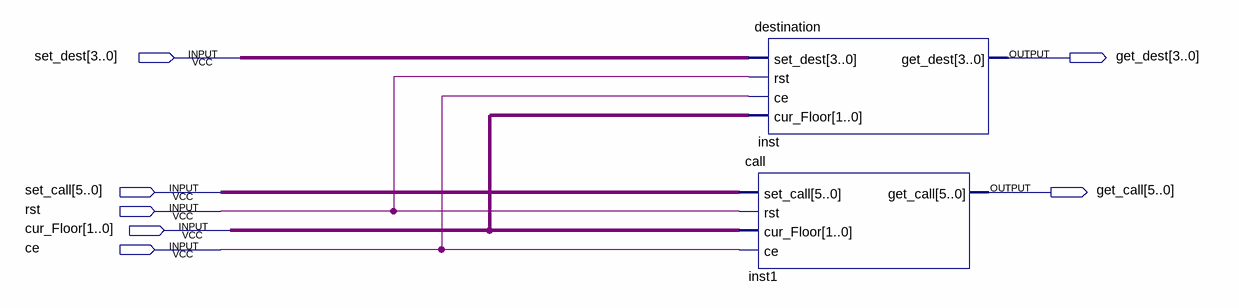
[diagram p0: schematic sheet]
// Quartus schematic request.bdf as structural Verilog: 2 symbols, 7 pins
module request (
  input  [3:0] set_dest,
  input  [5:0] set_call,
  input  rst,
  input  [1:0] cur_Floor,
  input  ce,
  output [3:0] get_dest,
  output [5:0] get_call
);

  destination inst (.set_dest(set_dest), .rst(rst), .ce(ce), .cur_Floor(cur_Floor), .get_dest(get_dest));
  call inst1 (.set_call(set_call), .rst(rst), .cur_Floor(cur_Floor), .ce(ce), .get_call(get_call));
endmodule
